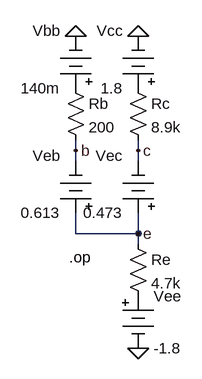
[diagram p0: schematic 24-5-7-b-1.asc]
24-5-7-b-1.asc, the LTspice schematic file:
Version 4
SHEET 1 880 680
WIRE 560 160 560 144
WIRE 656 160 656 144
WIRE 560 176 560 160
WIRE 656 176 656 160
WIRE 560 288 560 256
WIRE 656 288 656 256
WIRE 656 288 560 288
WIRE 656 304 656 288
FLAG 656 -16 0
FLAG 560 -16 0
FLAG 560 160 b
FLAG 656 160 c
FLAG 656 464 0
FLAG 656 288 e
SYMBOL Misc\\battery 560 272 R180
WINDOW 0 24 104 Left 2
WINDOW 3 24 16 Left 2
WINDOW 123 0 0 Left 0
WINDOW 39 0 0 Left 0
SYMATTR InstName Veb
SYMATTR Value 0.613
SYMBOL Misc\\battery 656 272 R180
WINDOW 0 24 104 Left 2
WINDOW 3 24 16 Left 2
WINDOW 123 0 0 Left 0
WINDOW 39 0 0 Left 0
SYMATTR InstName Vec
SYMATTR Value 0.473
SYMBOL Misc\\battery 560 80 R180
WINDOW 0 24 104 Left 2
WINDOW 3 24 16 Left 2
WINDOW 123 0 0 Left 0
WINDOW 39 0 0 Left 0
SYMATTR InstName Vbb
SYMATTR Value 140m
SYMBOL Misc\\battery 656 80 R180
WINDOW 0 24 104 Left 2
WINDOW 3 24 16 Left 2
WINDOW 123 0 0 Left 0
WINDOW 39 0 0 Left 0
SYMATTR InstName Vcc
SYMATTR Value 1.8
SYMBOL Misc\\battery 656 368 R0
WINDOW 123 0 0 Left 0
WINDOW 39 0 0 Left 0
SYMATTR InstName Vee
SYMATTR Value -1.8
SYMBOL res 544 48 R0
SYMATTR InstName Rb
SYMATTR Value 200
SYMBOL res 640 48 R0
SYMATTR InstName Rc
SYMATTR Value 8.9k
SYMBOL res 640 288 R0
SYMATTR InstName Re
SYMATTR Value 4.7k
TEXT 550 324 Left 2 !.op

The netlist it stands for:
* 24-5-7-b-1.asc
Veb e b 0.613
Vec e c 0.473
Vbb P001 0 140m
Vcc P002 0 1.8
Vee P003 0 -1.8
Rb P001 b 200
Rc P002 c 8.9k
Re e P003 4.7k
.op
.backanno
.end

* Results of the author's LTspice run, read from the files saved beside the schematic
* Operating Point:
*   V(e) = 683.1 mV
*   V(b) = 70.07 mV
*   V(c) = 210.1 mV
*   V(p001) = 140 mV
*   V(p002) = 1.8 V
*   V(p003) = -1.8 V
*   I(Re) = 528.3 µA
*   I(Rc) = 178.6 µA
*   I(Rb) = 349.7 µA
*   I(Vee) = 528.3 µA
*   I(Vcc) = -178.6 µA
*   I(Vbb) = -349.7 µA
*   I(Vec) = -178.6 µA
*   I(Veb) = -349.7 µA